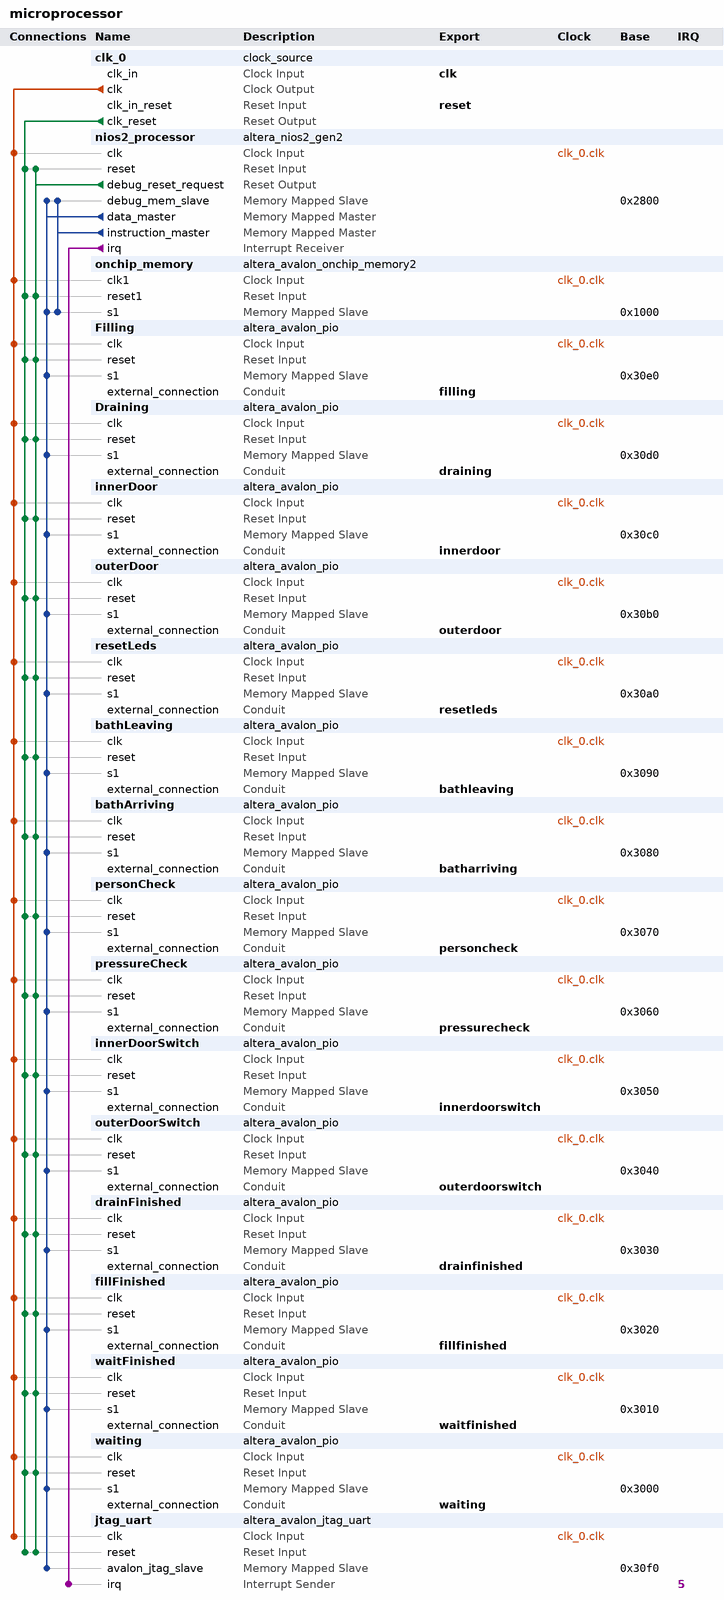
[diagram p0: system contents]
# Platform Designer (Qsys) system microprocessor, Cyclone V 5CSEMA5F31C6
# Parameters at their usual value, and those the tool derives, are not listed.
package require -exact qsys 15.1
create_system microprocessor
set_project_property DEVICE_FAMILY {Cyclone V}
set_project_property DEVICE 5CSEMA5F31C6

add_instance clk_0 clock_source 15.1
set_instance_parameter_value clk_0 clockFrequency 50000000

add_instance nios2_processor altera_nios2_gen2 15.1
set_instance_parameter_value nios2_processor dcache_size 2048
set_instance_parameter_value nios2_processor exceptionSlave onchip_memory.s1
set_instance_parameter_value nios2_processor icache_size 4096
set_instance_parameter_value nios2_processor impl Tiny
set_instance_parameter_value nios2_processor resetSlave onchip_memory.s1

add_instance onchip_memory altera_avalon_onchip_memory2 15.1
set_instance_parameter_value onchip_memory dataWidth 32
set_instance_parameter_value onchip_memory dualPort false
set_instance_parameter_value onchip_memory initMemContent true
set_instance_parameter_value onchip_memory initializationFileName onchip_mem.hex
set_instance_parameter_value onchip_memory memorySize 4096

add_instance Filling altera_avalon_pio 15.1
set_instance_parameter_value Filling direction Input
set_instance_parameter_value Filling width 1

add_instance Draining altera_avalon_pio 15.1
set_instance_parameter_value Draining direction Input
set_instance_parameter_value Draining width 1

add_instance innerDoor altera_avalon_pio 15.1
set_instance_parameter_value innerDoor direction Input
set_instance_parameter_value innerDoor width 1

add_instance outerDoor altera_avalon_pio 15.1
set_instance_parameter_value outerDoor direction Input
set_instance_parameter_value outerDoor width 1

add_instance resetLeds altera_avalon_pio 15.1
set_instance_parameter_value resetLeds direction Input
set_instance_parameter_value resetLeds width 4

add_instance bathLeaving altera_avalon_pio 15.1
set_instance_parameter_value bathLeaving direction Output
set_instance_parameter_value bathLeaving width 1

add_instance bathArriving altera_avalon_pio 15.1
set_instance_parameter_value bathArriving direction Output
set_instance_parameter_value bathArriving width 1

add_instance personCheck altera_avalon_pio 15.1
set_instance_parameter_value personCheck direction Output
set_instance_parameter_value personCheck width 1

add_instance pressureCheck altera_avalon_pio 15.1
set_instance_parameter_value pressureCheck direction Output
set_instance_parameter_value pressureCheck width 1

add_instance innerDoorSwitch altera_avalon_pio 15.1
set_instance_parameter_value innerDoorSwitch direction Output
set_instance_parameter_value innerDoorSwitch width 1

add_instance outerDoorSwitch altera_avalon_pio 15.1
set_instance_parameter_value outerDoorSwitch direction Output
set_instance_parameter_value outerDoorSwitch width 1

add_instance drainFinished altera_avalon_pio 15.1
set_instance_parameter_value drainFinished direction Output
set_instance_parameter_value drainFinished width 1

add_instance fillFinished altera_avalon_pio 15.1
set_instance_parameter_value fillFinished direction Output
set_instance_parameter_value fillFinished width 1

add_instance waitFinished altera_avalon_pio 15.1
set_instance_parameter_value waitFinished direction Output
set_instance_parameter_value waitFinished width 1

add_instance waiting altera_avalon_pio 15.1
set_instance_parameter_value waiting direction Input
set_instance_parameter_value waiting width 1

add_instance jtag_uart altera_avalon_jtag_uart 15.1
set_instance_parameter_value jtag_uart simInteractiveOptions NO_INTERACTIVE_WINDOWS

# connections
add_connection clk_0.clk bathArriving.clk clock
add_connection clk_0.clk bathLeaving.clk clock
add_connection clk_0.clk drainFinished.clk clock
add_connection clk_0.clk Draining.clk clock
add_connection clk_0.clk fillFinished.clk clock
add_connection clk_0.clk Filling.clk clock
add_connection clk_0.clk innerDoor.clk clock
add_connection clk_0.clk innerDoorSwitch.clk clock
add_connection clk_0.clk jtag_uart.clk clock
add_connection clk_0.clk nios2_processor.clk clock
add_connection clk_0.clk onchip_memory.clk1 clock
add_connection clk_0.clk outerDoor.clk clock
add_connection clk_0.clk outerDoorSwitch.clk clock
add_connection clk_0.clk personCheck.clk clock
add_connection clk_0.clk pressureCheck.clk clock
add_connection clk_0.clk resetLeds.clk clock
add_connection clk_0.clk waitFinished.clk clock
add_connection clk_0.clk waiting.clk clock
add_connection clk_0.clk_reset bathArriving.reset reset
add_connection clk_0.clk_reset bathLeaving.reset reset
add_connection clk_0.clk_reset drainFinished.reset reset
add_connection clk_0.clk_reset Draining.reset reset
add_connection clk_0.clk_reset fillFinished.reset reset
add_connection clk_0.clk_reset Filling.reset reset
add_connection clk_0.clk_reset innerDoor.reset reset
add_connection clk_0.clk_reset innerDoorSwitch.reset reset
add_connection clk_0.clk_reset jtag_uart.reset reset
add_connection clk_0.clk_reset nios2_processor.reset reset
add_connection clk_0.clk_reset onchip_memory.reset1 reset
add_connection clk_0.clk_reset outerDoor.reset reset
add_connection clk_0.clk_reset outerDoorSwitch.reset reset
add_connection clk_0.clk_reset personCheck.reset reset
add_connection clk_0.clk_reset pressureCheck.reset reset
add_connection clk_0.clk_reset resetLeds.reset reset
add_connection clk_0.clk_reset waitFinished.reset reset
add_connection clk_0.clk_reset waiting.reset reset
add_connection nios2_processor.debug_reset_request bathArriving.reset reset
add_connection nios2_processor.debug_reset_request bathLeaving.reset reset
add_connection nios2_processor.debug_reset_request drainFinished.reset reset
add_connection nios2_processor.debug_reset_request Draining.reset reset
add_connection nios2_processor.debug_reset_request fillFinished.reset reset
add_connection nios2_processor.debug_reset_request Filling.reset reset
add_connection nios2_processor.debug_reset_request innerDoor.reset reset
add_connection nios2_processor.debug_reset_request innerDoorSwitch.reset reset
add_connection nios2_processor.debug_reset_request jtag_uart.reset reset
add_connection nios2_processor.debug_reset_request nios2_processor.reset reset
add_connection nios2_processor.debug_reset_request onchip_memory.reset1 reset
add_connection nios2_processor.debug_reset_request outerDoor.reset reset
add_connection nios2_processor.debug_reset_request outerDoorSwitch.reset reset
add_connection nios2_processor.debug_reset_request personCheck.reset reset
add_connection nios2_processor.debug_reset_request pressureCheck.reset reset
add_connection nios2_processor.debug_reset_request resetLeds.reset reset
add_connection nios2_processor.debug_reset_request waitFinished.reset reset
add_connection nios2_processor.debug_reset_request waiting.reset reset
add_connection nios2_processor.data_master bathArriving.s1 avalon
set_connection_parameter_value nios2_processor.data_master/bathArriving.s1 baseAddress 0x3080
add_connection nios2_processor.data_master bathLeaving.s1 avalon
set_connection_parameter_value nios2_processor.data_master/bathLeaving.s1 baseAddress 0x3090
add_connection nios2_processor.data_master drainFinished.s1 avalon
set_connection_parameter_value nios2_processor.data_master/drainFinished.s1 baseAddress 0x3030
add_connection nios2_processor.data_master Draining.s1 avalon
set_connection_parameter_value nios2_processor.data_master/Draining.s1 baseAddress 0x30d0
add_connection nios2_processor.data_master fillFinished.s1 avalon
set_connection_parameter_value nios2_processor.data_master/fillFinished.s1 baseAddress 0x3020
add_connection nios2_processor.data_master Filling.s1 avalon
set_connection_parameter_value nios2_processor.data_master/Filling.s1 baseAddress 0x30e0
add_connection nios2_processor.data_master innerDoor.s1 avalon
set_connection_parameter_value nios2_processor.data_master/innerDoor.s1 baseAddress 0x30c0
add_connection nios2_processor.data_master innerDoorSwitch.s1 avalon
set_connection_parameter_value nios2_processor.data_master/innerDoorSwitch.s1 baseAddress 0x3050
add_connection nios2_processor.data_master jtag_uart.avalon_jtag_slave avalon
set_connection_parameter_value nios2_processor.data_master/jtag_uart.avalon_jtag_slave baseAddress 0x30f0
add_connection nios2_processor.data_master nios2_processor.debug_mem_slave avalon
set_connection_parameter_value nios2_processor.data_master/nios2_processor.debug_mem_slave baseAddress 0x2800
add_connection nios2_processor.data_master onchip_memory.s1 avalon
set_connection_parameter_value nios2_processor.data_master/onchip_memory.s1 baseAddress 0x1000
add_connection nios2_processor.data_master outerDoor.s1 avalon
set_connection_parameter_value nios2_processor.data_master/outerDoor.s1 baseAddress 0x30b0
add_connection nios2_processor.data_master outerDoorSwitch.s1 avalon
set_connection_parameter_value nios2_processor.data_master/outerDoorSwitch.s1 baseAddress 0x3040
add_connection nios2_processor.data_master personCheck.s1 avalon
set_connection_parameter_value nios2_processor.data_master/personCheck.s1 baseAddress 0x3070
add_connection nios2_processor.data_master pressureCheck.s1 avalon
set_connection_parameter_value nios2_processor.data_master/pressureCheck.s1 baseAddress 0x3060
add_connection nios2_processor.data_master resetLeds.s1 avalon
set_connection_parameter_value nios2_processor.data_master/resetLeds.s1 baseAddress 0x30a0
add_connection nios2_processor.data_master waitFinished.s1 avalon
set_connection_parameter_value nios2_processor.data_master/waitFinished.s1 baseAddress 0x3010
add_connection nios2_processor.data_master waiting.s1 avalon
set_connection_parameter_value nios2_processor.data_master/waiting.s1 baseAddress 0x3000
add_connection nios2_processor.instruction_master nios2_processor.debug_mem_slave avalon
set_connection_parameter_value nios2_processor.instruction_master/nios2_processor.debug_mem_slave baseAddress 0x2800
add_connection nios2_processor.instruction_master onchip_memory.s1 avalon
set_connection_parameter_value nios2_processor.instruction_master/onchip_memory.s1 baseAddress 0x1000
add_connection nios2_processor.irq jtag_uart.irq interrupt
set_connection_parameter_value nios2_processor.irq/jtag_uart.irq irqNumber 5

# exported interfaces
add_interface batharriving conduit end
set_interface_property batharriving EXPORT_OF bathArriving.external_connection
add_interface bathleaving conduit end
set_interface_property bathleaving EXPORT_OF bathLeaving.external_connection
add_interface clk clock sink
set_interface_property clk EXPORT_OF clk_0.clk_in
add_interface drainfinished conduit end
set_interface_property drainfinished EXPORT_OF drainFinished.external_connection
add_interface draining conduit end
set_interface_property draining EXPORT_OF Draining.external_connection
add_interface fillfinished conduit end
set_interface_property fillfinished EXPORT_OF fillFinished.external_connection
add_interface filling conduit end
set_interface_property filling EXPORT_OF Filling.external_connection
add_interface innerdoor conduit end
set_interface_property innerdoor EXPORT_OF innerDoor.external_connection
add_interface innerdoorswitch conduit end
set_interface_property innerdoorswitch EXPORT_OF innerDoorSwitch.external_connection
add_interface outerdoor conduit end
set_interface_property outerdoor EXPORT_OF outerDoor.external_connection
add_interface outerdoorswitch conduit end
set_interface_property outerdoorswitch EXPORT_OF outerDoorSwitch.external_connection
add_interface personcheck conduit end
set_interface_property personcheck EXPORT_OF personCheck.external_connection
add_interface pressurecheck conduit end
set_interface_property pressurecheck EXPORT_OF pressureCheck.external_connection
add_interface reset reset sink
set_interface_property reset EXPORT_OF clk_0.clk_in_reset
add_interface resetleds conduit end
set_interface_property resetleds EXPORT_OF resetLeds.external_connection
add_interface waitfinished conduit end
set_interface_property waitfinished EXPORT_OF waitFinished.external_connection
add_interface waiting conduit end
set_interface_property waiting EXPORT_OF waiting.external_connection

set_interconnect_requirement {$system} qsys_mm.clockCrossingAdapter HANDSHAKE
set_interconnect_requirement {$system} qsys_mm.enableEccProtection FALSE
set_interconnect_requirement {$system} qsys_mm.insertDefaultSlave FALSE
set_interconnect_requirement {$system} qsys_mm.maxAdditionalLatency 1

save_system microprocessor.qsys
